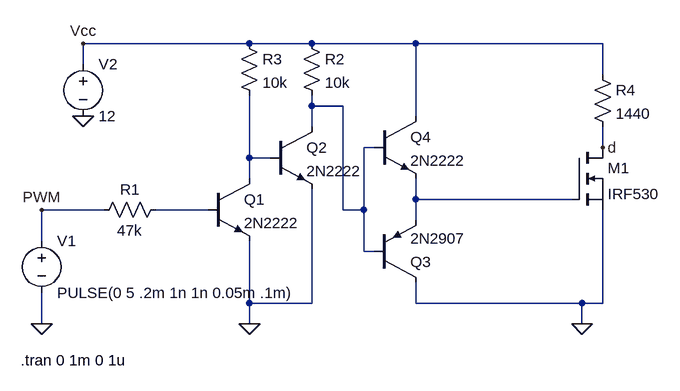
[diagram p0: schematic LED strip drive push-pull.asc]
LED strip drive push-pull.asc, the LTspice schematic file:
Version 4
SHEET 1 1016 680
WIRE 256 -208 0 -208
WIRE 352 -208 256 -208
WIRE 512 -208 352 -208
WIRE 800 -208 512 -208
WIRE 0 -176 0 -208
WIRE 800 -160 800 -208
WIRE 352 -112 352 -128
WIRE 400 -112 352 -112
WIRE 512 -96 512 -208
WIRE 352 -80 352 -112
WIRE 448 -48 432 -48
WIRE 800 -48 800 -80
WIRE 256 -32 256 -128
WIRE 288 -32 256 -32
WIRE 256 0 256 -32
WIRE 512 32 512 0
WIRE 752 32 512 32
WIRE 32 48 -64 48
WIRE 192 48 112 48
WIRE 400 48 400 -112
WIRE 432 48 432 -48
WIRE 432 48 400 48
WIRE 512 64 512 32
WIRE -64 96 -64 48
WIRE 432 112 432 48
WIRE 448 112 432 112
WIRE 256 192 256 96
WIRE 352 192 352 16
WIRE 352 192 256 192
WIRE 512 192 512 160
WIRE 768 192 512 192
WIRE 800 192 800 48
WIRE 800 192 768 192
WIRE -64 224 -64 176
WIRE 256 224 256 192
WIRE 768 224 768 192
FLAG -64 224 0
FLAG 256 224 0
FLAG 0 -96 0
FLAG 768 224 0
FLAG -64 48 PWM
FLAG 0 -208 Vcc
FLAG 800 -48 d
SYMBOL voltage -64 80 R0
WINDOW 123 0 0 Left 0
WINDOW 39 0 0 Left 0
SYMATTR InstName V1
SYMATTR Value PULSE(0 5 .2m 1n 1n 0.05m .1m)
SYMBOL nmos 752 -48 R0
SYMATTR InstName M1
SYMATTR Value IRF530
SYMBOL npn 192 0 R0
SYMATTR InstName Q1
SYMATTR Value 2N2222
SYMBOL res 128 32 R90
WINDOW 0 0 56 VBottom 2
WINDOW 3 32 56 VTop 2
SYMATTR InstName R1
SYMATTR Value 47k
SYMBOL voltage 0 -192 R0
WINDOW 123 0 0 Left 0
WINDOW 39 0 0 Left 0
SYMATTR InstName V2
SYMATTR Value 12
SYMBOL res 784 -176 R0
SYMATTR InstName R4
SYMATTR Value 1440
SYMBOL pnp 448 160 M180
SYMATTR InstName Q3
SYMATTR Value 2N2907
SYMBOL npn 448 -96 R0
SYMATTR InstName Q4
SYMATTR Value 2N2222
SYMBOL res 240 -224 R0
SYMATTR InstName R3
SYMATTR Value 10k
SYMBOL npn 288 -80 R0
SYMATTR InstName Q2
SYMATTR Value 2N2222
SYMBOL res 336 -224 R0
SYMATTR InstName R2
SYMATTR Value 10k
TEXT -96 280 Left 2 !.tran 0 1m 0 1u

The netlist it stands for:
* LED strip drive push-pull.asc
V1 PWM 0 PULSE(0 5 .2m 1n 1n 0.05m .1m)
M1 d N003 0 0 IRF530
Q1 N002 N004 0 0 2N2222
R1 N004 PWM 47k
V2 Vcc 0 12
R4 Vcc d 1440
Q3 0 N001 N003 0 2N2907
Q4 Vcc N001 N003 0 2N2222
R3 Vcc N002 10k
Q2 N001 N002 0 0 2N2222
R2 Vcc N001 10k
.model NPN NPN
.model PNP PNP
.lib standard.bjt
.model NMOS NMOS
.model PMOS PMOS
.lib standard.mos
.tran 0 1m 0 1u
.backanno
.end